# Altium schematic sheet Regulation.SchDoc
size A
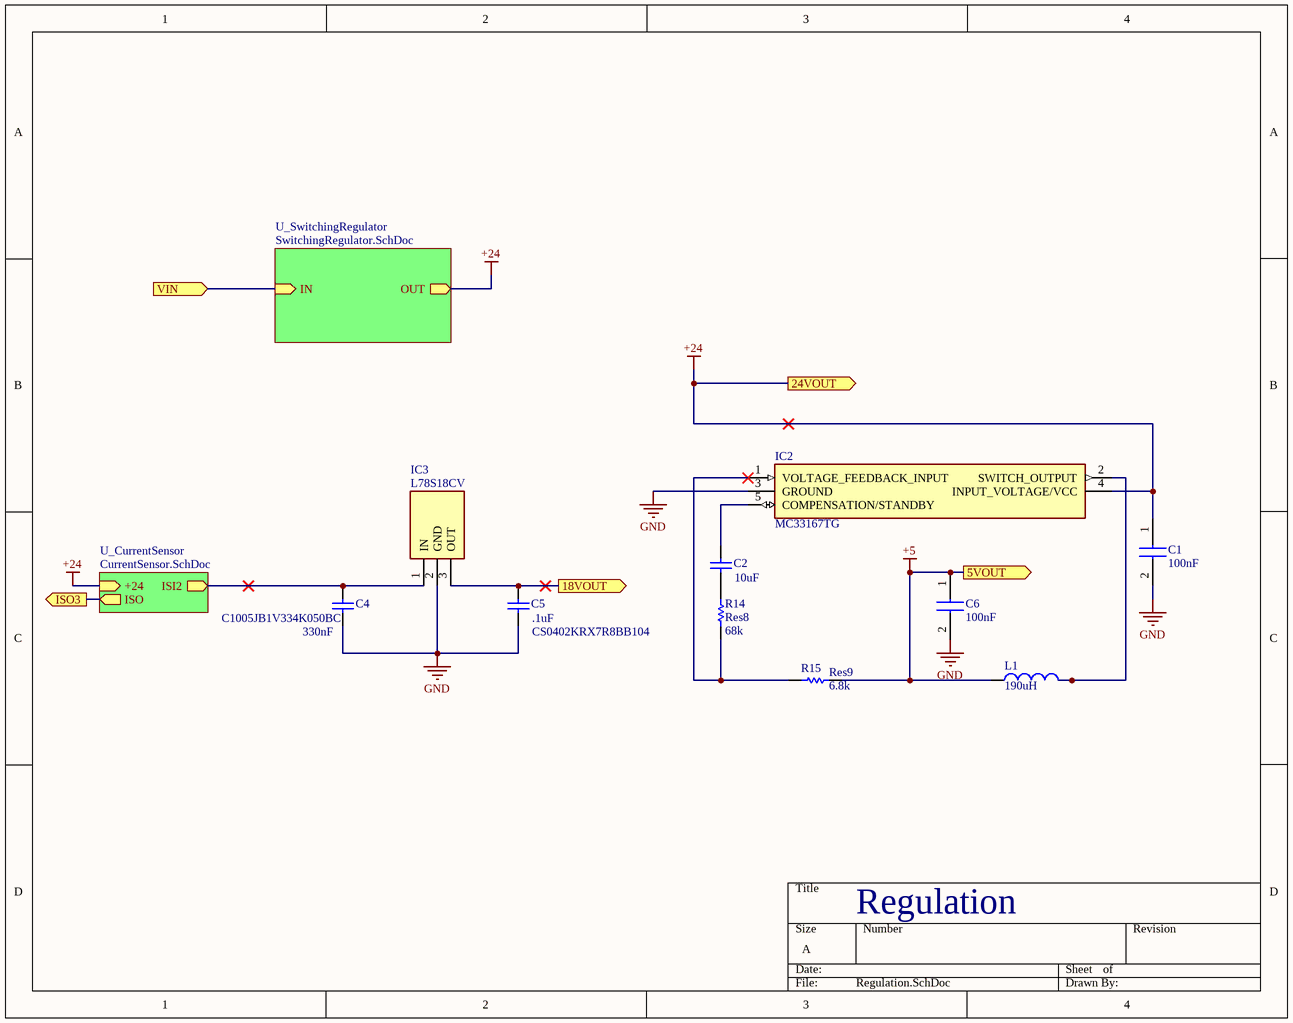
[diagram p0: Regulation.SchDoc]

## Parts
C1  100nF  [865230640001]
C2  value 10uF  [C0805]  (hidden comment: 10uF Cap)
C4  C1005JB1V334K050BC  value 330nF  [0402]
C5  CS0402KRX7R8BB104  value .1uF  [Model Name]
C6  100nF  [865230640001]
IC2  MC33167TG  [MC33167TG]
IC3  L78S18CV  [TO270P460X1020X2008-3P]
L1  value 190uH  [PA2982]  (hidden comment: 190uH Inductor)
R14  Res8  value 68k  [0402]
R15  Res9  value 6.8k  [0402]

## Sub-sheets
U_CurrentSensor = CurrentSensor.SchDoc: +24 (in), ISI2 (out), ISO (out)
U_SwitchingRegulator = SwitchingRegulator.SchDoc: IN (in), OUT (out)

## Ports
5VOUT (out), 18VOUT (out), 24VOUT (out), ISO3 (out), VIN (in)

## Nets
+5: C6.1(-) L1.1 R15.2 ; port 5VOUT
+24: C1.1(-) IC2.4(INPUT_VOLTAGE/VCC) ; port 24VOUT, sheet U_CurrentSensor/+24, sheet U_SwitchingRegulator/OUT
GND: C1.2(+) C4.1 C5.1 C6.2(+) IC2.3(GROUND) IC3.2(GND)
18VOUT: C5.2 IC3.3(OUT) ; port 18VOUT
ISO3: port ISO3, sheet U_CurrentSensor/ISO
VIN: port VIN, sheet U_SwitchingRegulator/IN
NetC2_1: C2.1 R14.2
NetC2_2: C2.2 IC2.5(COMPENSATION/STANDBY)
NetC4_2: C4.2 IC3.1(IN) ; sheet U_CurrentSensor/ISI2
NetIC2_1: IC2.1(VOLTAGE_FEEDBACK_INPUT) R14.1 R15.1
NetIC2_2: IC2.2(SWITCH_OUTPUT) L1.2

## Notes on the sheet
- Regulation

## Library data of the parts
C1 C6 = 865230640001: Capacitor; Manufacturer_Name: Wurth Elektronik; Datasheet Link: http://uk.rs-online.com/webdocs/135a/0900766b8135a640.pdf; Manufacturer_Part_Number: 865230640001; Arrow Part Number: 865230640001; Mouser Part Number: 710-865230640001; Mouser Price/Stock: https://www.mouser.co.uk/ProductDetail/Wurth-Elektronik/865230640001?qs=0KOYDY2FL28kfhWstjZGVg%3D%3D
C2 = Cap: Capacitor; Published: 8-Jun-2000; LatestRevisionDate: 17-Jul-2002; LatestRevisionNote: Re-released for DXP Platform.; PackageReference: RAD-0.3; Publisher: Altium Limited; PackageDescription: Radial Cap, Thru-Hole; 2 Leads; 0.3 in Pin Spacing
C4 = Cap: CAP CER 0.33UF 35V JB 0402; Manufacturer 1: TDK Corporation; Published: 8-Jun-2000; LatestRevisionDate: 17-Jul-2002; LatestRevisionNote: Re-released for DXP Platform.; PackageReference: RAD-0.3; Publisher: Altium Limited; PackageDescription: Radial Cap, Thru-Hole; 2 Leads; 0.3 in Pin Spacing; Manufacturer Part Number 1: C1005JB1V334K050BC
C5 = Cap: CAP CER 0.1UF 25V X7R 0402; Manufacturer 1: Yageo; LatestRevisionNote: Re-released for DXP Platform.; PackageReference: RAD-0.3; Publisher: Altium Limited; PackageDescription: Radial Cap, Thru-Hole; 2 Leads; 0.3 in Pin Spacing; Manufacturer Part Number 1: CS0402KRX7R8BB104
IC2 = MC33167TG: Integrated Circuit; Manufacturer_Name: ON Semiconductor; Allied_Number: 70340012; Datasheet Link: http://www.onsemi.com/pub/Collateral/MC34167-D.PDF; Manufacturer_Part_Number: MC33167TG; Mouser Part Number: 863-MC33167TG; Mouser Price/Stock: https://www.mouser.com/Search/Refine.aspx?Keyword=863-MC33167TG; RS Part Number: 7862414P; RS Price/Stock: http://uk.rs-online.com/web/p/products/7862414P; Allied Price/Stock: http://www.alliedelec.com/on-semiconductor-mc33167tg/70340012/
IC3 = L78S18CV: Integrated Circuit; Manufacturer_Name: STMicroelectronics; Allied_Number: 70013917; Datasheet Link: http://www.st.com/web/en/resource/technical/document/datasheet/CD00000449.pdf; Height: 4.6mm; Manufacturer_Part_Number: L78S18CV; Mouser Part Number: 511-L78S18CV; Mouser Price/Stock: https://www.mouser.com/Search/Refine.aspx?Keyword=511-L78S18CV; RS Part Number: 6869022P; RS Price/Stock: http://uk.rs-online.com/web/p/products/6869022P; Allied Price/Stock: http://www.alliedelec.com/stmicroelectronics-l78s18cv/70013917/
L1 = Inductor: Code_IEC: 1005; Published: 8-Jun-2000; LatestRevisionDate: 29-May-2009; LatestRevisionNote: IPC-7351 Footprint Added.; PackageReference: 0402-A; Publisher: Altium Limited; PackageDescription: Chip Inductor; Code_JEITA: 0402
R14 R15 = Res1: Resistor; Published: 8-Jun-2000; LatestRevisionDate: 17-Jul-2002; LatestRevisionNote: Re-released for DXP Platform.; PackageReference: AXIAL-0.3; Publisher: Altium Limited; PackageDescription: Axial Device, Thru-Hole; 2 Leads; 0.3 in Pin Spacing